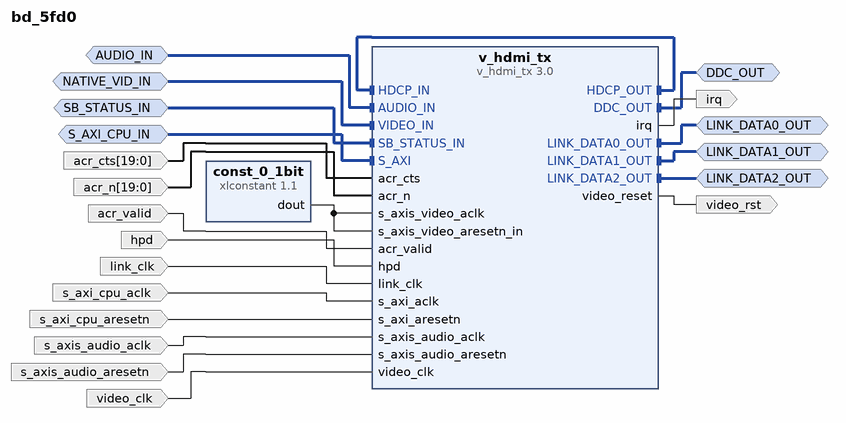
[diagram p0: block diagram of the top level]
# Vivado block design bd_5fd0, xc7a100tfgg484-2L, Vivado 2021.2
create_bd_design bd_5fd0

create_bd_intf_port -mode Master -vlnv xilinx.com:interface:axis_rtl:1.0 LINK_DATA0_OUT
create_bd_intf_port -mode Master -vlnv xilinx.com:interface:axis_rtl:1.0 LINK_DATA1_OUT
create_bd_intf_port -mode Master -vlnv xilinx.com:interface:axis_rtl:1.0 LINK_DATA2_OUT
create_bd_intf_port -mode Master -vlnv xilinx.com:interface:iic_rtl:1.0 DDC_OUT
create_bd_intf_port -mode Slave -vlnv xilinx.com:interface:aximm_rtl:1.0 S_AXI_CPU_IN
set_property -dict {CONFIG.ADDR_WIDTH 16 CONFIG.PROTOCOL AXI4LITE} [get_bd_intf_ports S_AXI_CPU_IN]
create_bd_intf_port -mode Slave -vlnv xilinx.com:interface:axis_rtl:1.0 AUDIO_IN
create_bd_intf_port -mode Slave -vlnv xilinx.com:interface:axis_rtl:1.0 SB_STATUS_IN
create_bd_intf_port -mode Slave -vlnv xilinx.com:interface:vid_io_rtl:1.0 NATIVE_VID_IN
create_bd_port -dir I -type clk s_axi_cpu_aclk
set_property -dict [list \
  CONFIG.ASSOCIATED_BUSIF SB_STATUS_IN:S_AXI_CPU_IN \
  CONFIG.ASSOCIATED_RESET s_axi_cpu_aresetn \
] [get_bd_ports s_axi_cpu_aclk]
create_bd_port -dir I -type rst s_axi_cpu_aresetn
create_bd_port -dir I -type clk link_clk
create_bd_port -dir I -type clk s_axis_audio_aclk
set_property -dict [list \
  CONFIG.ASSOCIATED_BUSIF AUDIO_IN \
  CONFIG.ASSOCIATED_RESET s_axis_audio_aresetn \
] [get_bd_ports s_axis_audio_aclk]
create_bd_port -dir I -type rst s_axis_audio_aresetn
create_bd_port -dir I -from 19 -to 0 acr_cts
create_bd_port -dir I -from 19 -to 0 acr_n
create_bd_port -dir I acr_valid
create_bd_port -dir I hpd
create_bd_port -dir O -type intr irq
create_bd_port -dir I -type clk video_clk
create_bd_port -dir O -type rst video_rst

create_bd_cell -type ip -vlnv xilinx.com:ip:v_hdmi_tx:3.0 v_hdmi_tx
set_property -dict [list \
  CONFIG.C_BITS_PER_COMPONENT 8 \
  CONFIG.C_CH_WIDTH 8 \
  CONFIG.C_HDCP_IF_ENABLE 0 \
  CONFIG.C_PIXELS_PER_CLOCK 2 \
  CONFIG.C_SIM_DEVICE VERSAL_AI_CORE_ES1 \
  CONFIG.C_SIM_DEVICE_EN 0 \
  CONFIG.C_TST_DBG 0 \
  CONFIG.C_VECTOR_DE_ENABLE 0 \
  CONFIG.C_VIDEO_MASK_ENABLE 1 \
] [get_bd_cells v_hdmi_tx]
create_bd_cell -type ip -vlnv xilinx.com:ip:xlconstant:1.1 const_0_1bit
set_property -dict {CONFIG.CONST_VAL 0} [get_bd_cells const_0_1bit]

# ---- connections ----

connect_bd_intf_net -intf_net intf_net_bdry_in_AUDIO_IN [get_bd_intf_ports AUDIO_IN] [get_bd_intf_pins v_hdmi_tx/AUDIO_IN]
connect_bd_intf_net -intf_net intf_net_bdry_in_NATIVE_VID_IN [get_bd_intf_ports NATIVE_VID_IN] [get_bd_intf_pins v_hdmi_tx/VIDEO_IN]
connect_bd_intf_net -intf_net intf_net_bdry_in_SB_STATUS_IN [get_bd_intf_ports SB_STATUS_IN] [get_bd_intf_pins v_hdmi_tx/SB_STATUS_IN]
connect_bd_intf_net -intf_net intf_net_bdry_in_S_AXI_CPU_IN [get_bd_intf_ports S_AXI_CPU_IN] [get_bd_intf_pins v_hdmi_tx/S_AXI]
connect_bd_intf_net -intf_net intf_net_v_hdmi_tx_DDC_OUT [get_bd_intf_ports DDC_OUT] [get_bd_intf_pins v_hdmi_tx/DDC_OUT]
connect_bd_intf_net -intf_net intf_net_v_hdmi_tx_LINK_DATA0_OUT [get_bd_intf_ports LINK_DATA0_OUT] [get_bd_intf_pins v_hdmi_tx/LINK_DATA0_OUT]
connect_bd_intf_net -intf_net intf_net_v_hdmi_tx_LINK_DATA1_OUT [get_bd_intf_ports LINK_DATA1_OUT] [get_bd_intf_pins v_hdmi_tx/LINK_DATA1_OUT]
connect_bd_intf_net -intf_net intf_net_v_hdmi_tx_LINK_DATA2_OUT [get_bd_intf_ports LINK_DATA2_OUT] [get_bd_intf_pins v_hdmi_tx/LINK_DATA2_OUT]
connect_bd_intf_net -intf_net intf_net_v_hdmi_tx_hdcp_out [get_bd_intf_pins v_hdmi_tx/HDCP_OUT] [get_bd_intf_pins v_hdmi_tx/HDCP_IN]
connect_bd_net -net net_bdry_in_acr_cts [get_bd_ports acr_cts] [get_bd_pins v_hdmi_tx/acr_cts]
connect_bd_net -net net_bdry_in_acr_n [get_bd_ports acr_n] [get_bd_pins v_hdmi_tx/acr_n]
connect_bd_net -net net_bdry_in_acr_valid [get_bd_ports acr_valid] [get_bd_pins v_hdmi_tx/acr_valid]
connect_bd_net -net net_bdry_in_hpd [get_bd_ports hpd] [get_bd_pins v_hdmi_tx/hpd]
connect_bd_net -net net_bdry_in_link_clk [get_bd_ports link_clk] [get_bd_pins v_hdmi_tx/link_clk]
connect_bd_net -net net_bdry_in_s_axi_cpu_aclk [get_bd_ports s_axi_cpu_aclk] [get_bd_pins v_hdmi_tx/s_axi_aclk]
connect_bd_net -net net_bdry_in_s_axi_cpu_aresetn [get_bd_ports s_axi_cpu_aresetn] [get_bd_pins v_hdmi_tx/s_axi_aresetn]
connect_bd_net -net net_bdry_in_s_axis_audio_aclk [get_bd_ports s_axis_audio_aclk] [get_bd_pins v_hdmi_tx/s_axis_audio_aclk]
connect_bd_net -net net_bdry_in_s_axis_audio_aresetn [get_bd_ports s_axis_audio_aresetn] [get_bd_pins v_hdmi_tx/s_axis_audio_aresetn]
connect_bd_net -net net_bdry_in_video_clk [get_bd_ports video_clk] [get_bd_pins v_hdmi_tx/video_clk]
connect_bd_net -net net_const_0_1bit_dout [get_bd_pins const_0_1bit/dout] \
  [get_bd_pins v_hdmi_tx/s_axis_video_aclk] [get_bd_pins v_hdmi_tx/s_axis_video_aresetn_in]
connect_bd_net -net net_v_hdmi_tx_irq [get_bd_pins v_hdmi_tx/irq] [get_bd_ports irq]
connect_bd_net -net net_v_hdmi_tx_video_reset [get_bd_pins v_hdmi_tx/video_reset] [get_bd_ports video_rst]

# ---- address map ----
assign_bd_address -offset 0x0000 -range 64K -target_address_space [get_bd_addr_spaces S_AXI_CPU_IN] [get_bd_addr_segs v_hdmi_tx/S_AXI/reg0]

validate_bd_design
save_bd_design
